# EAGLE design MIDI_Roundabout_revA (EAGLE 9.6.2)
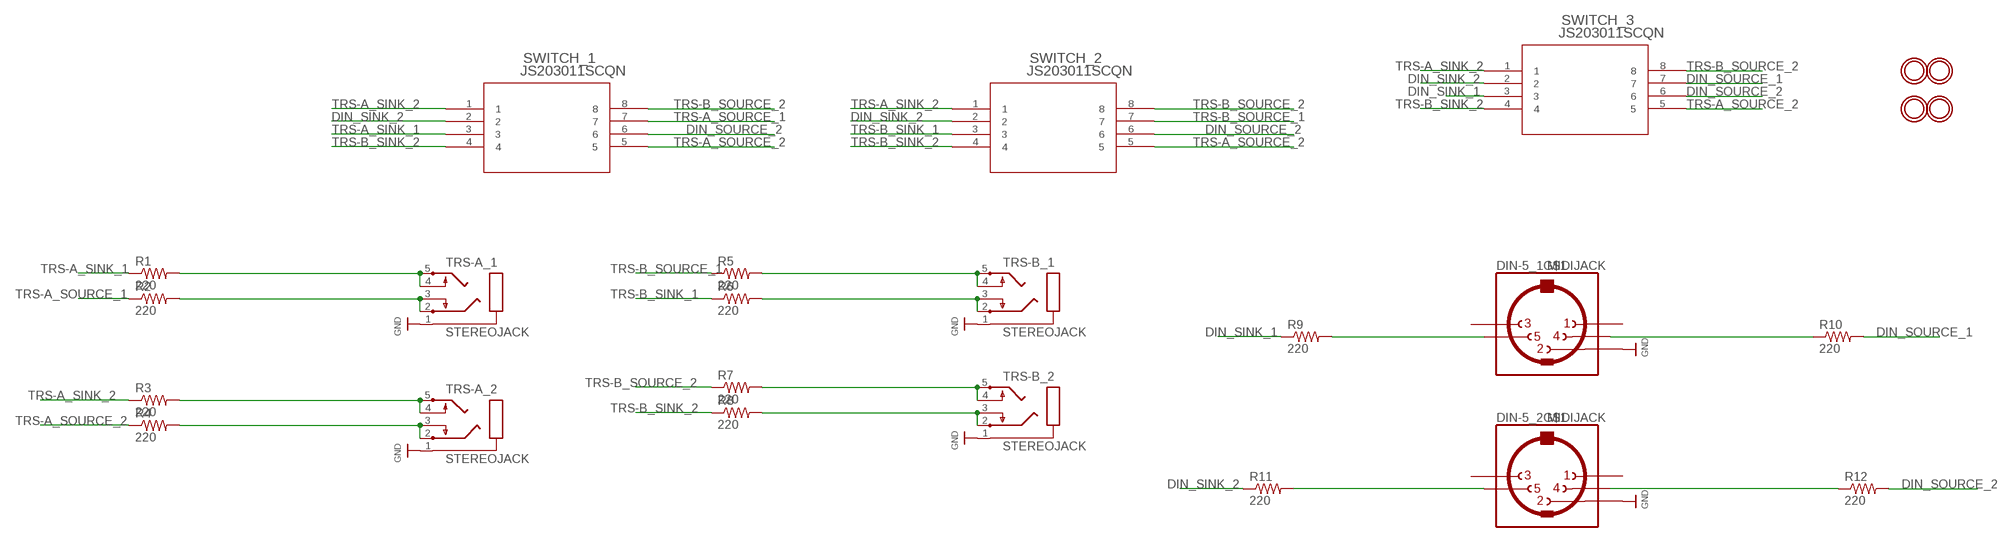
[diagram p0: schematic, sheet 1]

## Parts
DIN-5_1  MIDIJACK  [CP-2350]
DIN-5_2  MIDIJACK  [CP-2350]
R1  220  R-US_R0805  [R0805]
R2  220  R-US_R0805  [R0805]
R3  220  R-US_R0805  [R0805]
R4  220  R-US_R0805  [R0805]
R5  220  R-US_R0805  [R0805]
R6  220  R-US_R0805  [R0805]
R7  220  R-US_R0805  [R0805]
R8  220  R-US_R0805  [R0805]
R9  220  R-US_R0805  [R0805]
R10  220  R-US_R0805  [R0805]
R11  220  R-US_R0805  [R0805]
R12  220  R-US_R0805  [R0805]
SWITCH_1  JS203011SCQN  [SWITCH_3011SCQN]
SWITCH_2  JS203011SCQN  [SWITCH_3011SCQN]
SWITCH_3  JS203011SCQN  [SWITCH_3011SCQN]
TRS-A_1  STEREOJACK  [STX3100]
TRS-A_2  STEREOJACK  [STX3100]
TRS-B_1  STEREOJACK  [STX3100]
TRS-B_2  STEREOJACK  [STX3100]
U$7  MOUNTINGHOLE2.5_THICK  [MOUNTINGHOLE_2.5_PLATED_THICK]
U$8  MOUNTINGHOLE2.5_THICK  [MOUNTINGHOLE_2.5_PLATED_THICK]
U$9  MOUNTINGHOLE2.5_THICK  [MOUNTINGHOLE_2.5_PLATED_THICK]
U$10  MOUNTINGHOLE2.5_THICK  [MOUNTINGHOLE_2.5_PLATED_THICK]

## Nets
DIN_SINK_1: R9.1 SWITCH_3.3
DIN_SINK_2: R11.1 SWITCH_1.2 SWITCH_2.2 SWITCH_3.2
DIN_SOURCE_1: R10.2 SWITCH_3.7
DIN_SOURCE_2: R12.2 SWITCH_1.6 SWITCH_2.6 SWITCH_3.6
GND: DIN-5_1.2 DIN-5_2.2 TRS-A_1.1 TRS-A_2.1 TRS-B_1.1 TRS-B_2.1
N$1: DIN-5_1.5 R9.2
N$2: DIN-5_1.4 R10.1
N$3: DIN-5_2.4 R12.1
N$4: DIN-5_2.5 R11.2
N$5: R1.2 TRS-A_1.4 TRS-A_1.5
N$6: R2.2 TRS-A_1.2 TRS-A_1.3
N$7: R3.2 TRS-A_2.4 TRS-A_2.5
N$8: R4.2 TRS-A_2.2 TRS-A_2.3
N$9: R5.2 TRS-B_1.4 TRS-B_1.5
N$10: R6.2 TRS-B_1.2 TRS-B_1.3
N$11: R7.2 TRS-B_2.4 TRS-B_2.5
N$12: R8.2 TRS-B_2.2 TRS-B_2.3
TRS-A_SINK_1: R1.1 SWITCH_1.3
TRS-A_SINK_2: R3.1 SWITCH_1.1 SWITCH_2.1 SWITCH_3.1
TRS-A_SOURCE_1: R2.1 SWITCH_1.7
TRS-A_SOURCE_2: R4.1 SWITCH_1.5 SWITCH_2.5 SWITCH_3.5
TRS-B_SINK_1: R6.1 SWITCH_2.3
TRS-B_SINK_2: R8.1 SWITCH_1.4 SWITCH_2.4 SWITCH_3.4
TRS-B_SOURCE_1: R5.1 SWITCH_2.7
TRS-B_SOURCE_2: R7.1 SWITCH_1.8 SWITCH_2.8 SWITCH_3.8
Unconnected: DIN-5_1.1 DIN-5_1.3 DIN-5_1.PE1(MT) DIN-5_1.PE2(MT) DIN-5_1.PE(MT) DIN-5_1.PE@(MT) DIN-5_2.1 DIN-5_2.3 DIN-5_2.PE1(MT) DIN-5_2.PE2(MT) DIN-5_2.PE(MT) DIN-5_2.PE@(MT)

## Library data of the parts
DIN-5_1 DIN-5_2 = adafruit:MIDIJACK: DIN 5 jack also known as MIDI jack A modification of conn-hirshman:MAB5SH with two options for the grounding 'teeth'
R1-R12 = adafruit:R-US_: RESISTOR, American symbol
SWITCH_1-SWITCH_3 = blitz_lib:JS203011SCQN; COPYRIGHT: Copyright (C) 2025 Ultra Librarian. All rights reserved.; MANUFACTURER_PART_NUMBER: JS203011SCQN; MFR_NAME: C&K Components
TRS-A_1 TRS-A_2 TRS-B_1 TRS-B_2 = adafruit:STEREOJACK: MIC/HEADPHONE JACK Stereo jack with two switches. Kycon STX3100, CUI SJ1-3555NG and/or 4UCon 05544
U$7-U$10 = adafruit_electromech:MOUNTINGHOLE: Mounting Hole For #2 screws (0.086"/2.18mm width, 0.094"/2.4mm hole) use 2.5mm; BOM: EXCLUDE

## Board
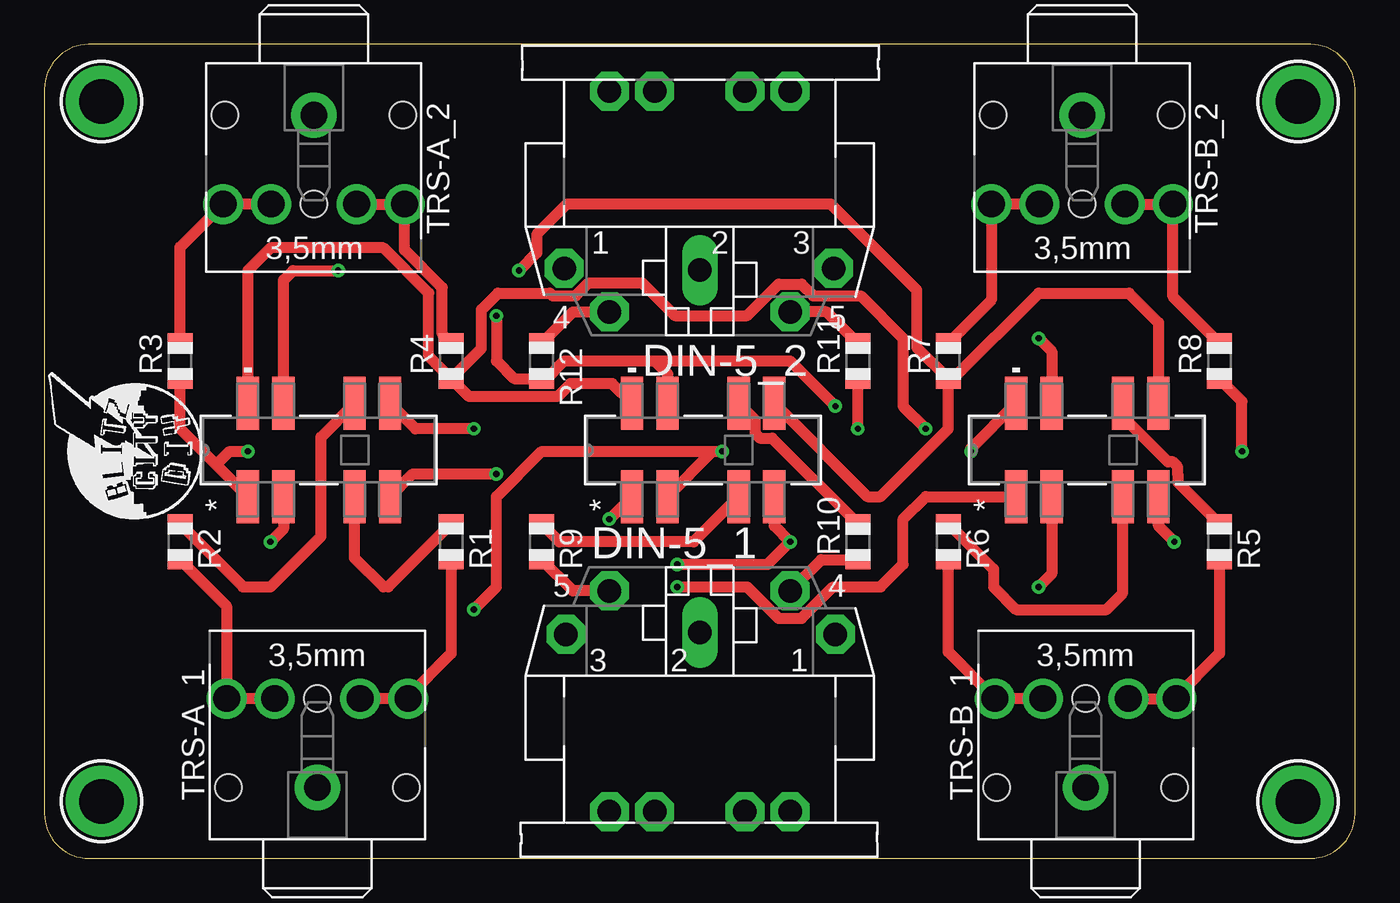
[diagram p1: board, top side]
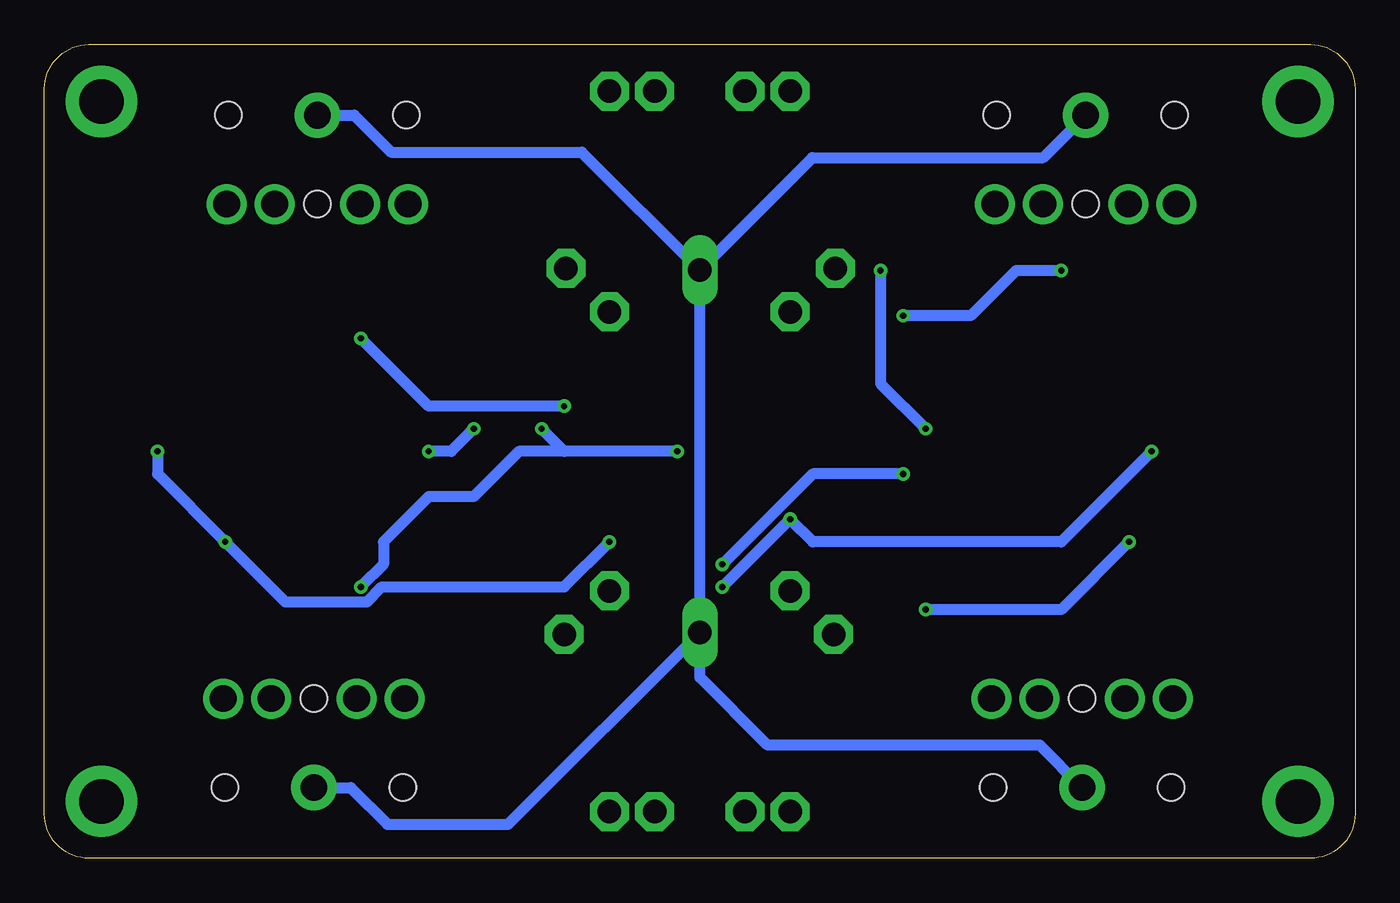
[diagram p2: board, bottom side, seen from below]

Size 73.66 x 45.72 mm. Coordinates in mm from the lower left corner, seen from the top.
Outline: 71.16,45.72 2.5,45.72 arc90 0,43.22 0,2.5 arc90 2.5,0 71.16,0 arc90 73.66,2.5 73.66,43.22 arc90 71.16,45.72
Copper layers (1*16): Top 0.035mm / dielectric 1.5mm / Bottom 0.035mm
Design rules "default": minimum track width 6mil, minimum drill 0.35mm, track to track 6mil, track to pad 6mil, pad to pad 6mil, via to via 6mil, smd to smd 6mil, copper to edge 40mil, drill to drill 6mil, minimum pad ring 10mil, minimum via ring 8mil, stop-mask expansion 4mil, vias tented up to drill 0mil, thermal gap 10mil

### Footprints (pad centres in the part's own frame; a part is rotated, then mirrored left to right if it is on the bottom)
CP-2350 = drill 1.321 pad 2.184 octagon: 1 7.62,12.58; 3 -7.52,12.58; 4 5.08,15.02; 5 -5.08,15.02; PE -2.54,2.62; PE1 -5.08,2.62; PE2 5.08,2.62; PE@ 2.54,2.62 | drill 1.321 long: 2 0,12.68
R0805 = smd 1.1 x 1.4: 1 -1,0; 2 1,0
SWITCH_3011SCQN = smd 2.972 x 1.245: 1 0,0; 2 0,-2; 3 0,-6; 4 0,-8; 5 5.232,0; 6 5.232,-2; 7 5.232,-6; 8 5.232,-8
STX3100 = drill 1.5 pad 2.54: 1 2.7,-0.1 | drill 1.5: 2 7.7,5; 3 7.7,2.3; 4 7.7,-2.5; 5 7.7,-5.2 | hole 1.5: 2.7,4.9; 2.7,-5.1; 7.7,-0.1
MOUNTINGHOLE_2.5_PLATED_THICK = drill 2.5 pad 4: P$1 0,0

### Placement (x,y rotation side)
DIN-5_1  36.83,0 0 top
DIN-5_2  36.83,45.72 180 top
PLABEL200  [PLABEL200]  7.62,33.02 90 top
PLABEL201  [PLABEL201]  25.4,33.02 90 top
PLABEL202  [PLABEL202]  50.8,33.02 90 top
PLABEL203  [PLABEL203]  67.41,1.91 90 top
PLABEL204  [PLABEL204]  49.81,1.91 90 top
PLABEL205  [PLABEL205]  24.13,1.91 90 top
PLABEL206  [PLABEL206]  4.14,6.17 0 top
PLABEL207  [PLABEL207]  64.62,37.01 0 top
PLABEL208  [PLABEL208]  71.96,20.09 90 top
PLABEL209  [PLABEL209]  29.97,17.07 0 top
PLABEL210  [PLABEL210]  51.71,14.58 0 top
PLABEL211  [PLABEL211]  8.71,14.58 0 top
PLABEL212  [PLABEL212]  71.12,25.93 90 top
PLABEL213  [PLABEL213]  71.12,15.04 90 top
PLABEL214  [PLABEL214]  24.89,22.86 90 top
PLABEL215  [PLABEL215]  47.4,22.86 90 top
PLABEL216  [PLABEL216]  4.17,17.78 90 top
PLABEL217  [PLABEL217]  4.19,29.24 90 top
PLABEL218  [PLABEL218]  45.72,19.58 90 top
PLABEL219  [PLABEL219]  45.72,26.37 90 top
R1  [R0805]  22.86,17.78 270 top
R2  [R0805]  7.62,17.78 270 top
R3  [R0805]  7.62,27.94 90 top
R4  [R0805]  22.86,27.94 90 top
R5  [R0805]  66.04,17.78 270 top
R6  [R0805]  50.8,17.78 270 top
R7  [R0805]  50.8,27.94 90 top
R8  [R0805]  66.04,27.94 90 top
R9  [R0805]  27.94,17.78 270 top
R10  [R0805]  45.72,17.78 90 top
R11  [R0805]  45.72,27.94 90 top
R12  [R0805]  27.94,27.94 270 top
SWITCH_1  11.43,20.32 90 top
SWITCH_2  54.61,20.32 90 top
SWITCH_3  33.02,20.32 90 top
TRS-A_1  15.24,1.27 90 top
TRS-A_2  15.24,44.45 270 top
TRS-B_1  58.42,1.27 90 top
TRS-B_2  58.42,44.45 270 top
U$7  3.2,3.2 0 top
U$8  3.2,42.52 0 top
U$9  70.46,3.2 0 top
U$10  70.46,42.52 0 top

### Tracks (layer width: path | path; a pad name or v marks a point on that pad's centre or on a via)
DIN_SINK_1
  Top 0.61: SWITCH_3.3 36.48,17.78 28.94,17.78 R9.1
DIN_SINK_2  (via drill 0.35)
  Top 0.61: SWITCH_3.2 37.56,22.86 v38.1,22.86 27.94,22.86 25.4,20.32 25.4,15.24 v24.13,13.97 | v45.72,24.13 R11.1 | SWITCH_1.2 13.43,18.51 v12.7,17.78 | SWITCH_2.2 56.61,15.97 v55.88,15.24
  Bottom 0.61: v38.1,22.86 44.45,22.86 | 44.45,22.86 v45.72,24.13 | v12.7,17.78 16.51,13.97 v24.13,13.97 | 44.45,22.86 46.99,22.86 49.53,20.32 52.07,20.32 54.61,17.78 54.61,16.51 v55.88,15.24
DIN_SOURCE_1
  Top 0.61: SWITCH_3.7 39.94,24.63 39.94,23.88 40.21,23.61 40.89,23.61 R10.2
DIN_SOURCE_2  (via drill 0.35)
  Top 0.61: 34.29,27.94 29.21,27.94 28.21,26.94 R12.2 26.4,26.94 25.4,27.94 v25.4,30.48 | 34.29,27.94 35.02,27.21 SWITCH_3.6 | SWITCH_1.6 13.43,32.48 13.97,33.02 v16.51,33.02 | 34.29,27.94 41.91,27.94 v44.45,25.4 | v55.88,29.21 56.61,28.48 SWITCH_2.6
  Bottom 0.61: v16.51,33.02 19.05,33.02 21.59,30.48 v25.4,30.48 | v44.45,25.4 52.07,25.4 v55.88,29.21
GND
  Bottom 0.61: TRS-A_1.1 17.72,6.35 33.02,6.35 36.83,10.16 DIN-5_1.2 | TRS-B_1.1 56.45,3.97 54.38,1.9 47.61,1.9 DIN-5_1.2 | TRS-B_2.1 56.25,41.75 54.18,39.68 43.47,39.68 DIN-5_2.2 | DIN-5_2.2 30.5,39.37 17.52,39.37 TRS-A_2.1 | DIN-5_1.2 DIN-5_2.2
N$1
  Top 0.61: DIN-5_1.5 29.7,15.02 R9.2
N$2
  Top 0.61: DIN-5_1.4 43.67,16.78 R10.1
N$3
  Top 0.61: R12.1 29.7,30.7 DIN-5_2.4
N$4
  Top 0.61: R11.2 43.96,30.7 DIN-5_2.5
N$5
  Top 0.61: TRS-A_1.5 20.32,8.97 | 20.32,8.97 TRS-A_1.4 | R1.2 22.86,11.51 20.32,8.97
N$6
  Top 0.61: TRS-A_1.3 TRS-A_1.2 10.24,14.16 R2.2
N$7
  Top 0.61: R3.2 7.62,34.33 TRS-A_2.5 TRS-A_2.4
N$8
  Top 0.61: TRS-A_2.3 TRS-A_2.2 20.24,34.18 22.35,32.07 22.35,29.45 R4.2
N$9
  Top 0.61: TRS-B_1.4 63.5,8.97 | 63.5,8.97 TRS-B_1.5 | R5.2 66.04,11.51 63.5,8.97
N$10
  Top 0.61: TRS-B_1.3 TRS-B_1.2 50.8,11.59 R6.2
N$11
  Top 0.61: R7.2 53.22,31.36 TRS-B_2.5 TRS-B_2.4
N$12
  Top 0.61: TRS-B_2.3 TRS-B_2.2 63.42,31.56 R8.2
TRS-A_SINK_1
  Top 0.61: R1.1 19.32,15.24 19.05,15.24 17.43,16.86 SWITCH_1.3
TRS-A_SINK_2  (via drill 0.35)
  Top 0.61: SWITCH_1.1 9.65,22.1 | 9.65,22.1 7.62,24.13 R3.1 | v11.43,22.86 10.41,22.86 9.65,22.1 | v31.75,19.05 SWITCH_3.1 | v35.56,15.24 39.5,15.24 41.27,13.47 42.55,13.47 44.32,15.24 46.99,15.24 48.26,16.51 48.26,19.05 49.53,20.32 SWITCH_2.1
  Bottom 0.61: v11.43,22.86 16.51,17.78 30.48,17.78 v31.75,19.05 v35.56,15.24
TRS-A_SOURCE_1
  Top 0.61: R2.1 11.16,15.24 12.7,15.24 15.54,18.08 15.54,23.66 SWITCH_1.7
TRS-A_SOURCE_2  (via drill 0.35)
  Top 0.61: R4.1 21.59,28.21 21.59,31.75 19.05,34.29 12.7,34.29 11.43,33.02 SWITCH_1.5 11.43,25.4 | SWITCH_3.5 31.9,26.67 29.57,26.67 28.83,25.93 23.87,25.93 R4.1 | R4.1 24.57,28.64 24.57,30.83 25.49,31.75 28.41,31.75 28.57,31.59 29.85,31.59 30.58,32.32 33.59,32.32 35.43,30.48 39.5,30.48 41.27,32.25 42.55,32.25 43.21,31.59 45.88,31.59 48.26,29.21 48.26,25.4 v49.53,24.13 | v52.07,22.86 52.07,23.01 SWITCH_2.5
  Bottom 0.61: v49.53,24.13 50.8,22.86 v52.07,22.86
TRS-B_SINK_1
  Top 0.61: SWITCH_2.3 60.61,14.89 59.69,13.97 54.61,13.97 53.34,15.24 53.34,16.24 R6.1
TRS-B_SINK_2  (via drill 0.35)
  Top 0.61: v67.31,22.86 67.31,25.67 R8.1 | v63.5,17.78 62.61,18.67 SWITCH_2.4 | SWITCH_3.4 41.02,18.67 v41.91,17.78 40.64,16.51 v35.56,16.51 | SWITCH_1.4 20.7,21.59 v25.4,21.59
  Bottom 0.61: v67.31,22.86 67.31,21.59 v63.5,17.78 60.12,14.4 55.53,14.4 54.7,15.24 44.45,15.24 v41.91,17.78 | v25.4,21.59 30.48,21.59 v35.56,16.51
TRS-B_SOURCE_1
  Top 0.61: SWITCH_2.7 60.61,24.8 63.15,22.26 63.42,22.26 63.69,22 63.69,21.59 63.69,21.13 R5.1
TRS-B_SOURCE_2  (via drill 0.35)
  Top 0.61: SWITCH_2.8 62.61,30.1 60.96,31.75 55.88,31.75 51.07,26.94 R7.1 | SWITCH_3.8 46.25,20.32 46.99,20.32 50.8,24.13 R7.1 | v26.67,33.02 27.66,34.01 27.66,35.05 29.36,36.75 44.2,36.75 49.02,31.93 49.02,28.72 R7.1 | v24.13,24.13 20.85,24.13 SWITCH_1.8
  Bottom 0.61: v26.67,33.02 26.67,26.67 v24.13,24.13

### Text on the board
Pinguin_tBackup: ⬆️ | TRS-A Out | DIN-5 Out | TRS-B Out | 🎹 | 🔃 | ⚡ | MIDI / ROUNDABOUT | v0 / June 2025 | ⚡ | 🚦 | ↖️⬆️↗️ | 🔃 | ⬆️↗️➡️ | ⬅️↖️⬆️ | 🎛️ | ⬆️ | TRS-A In | DIN-5 In | TRS-B In